# EasyEDA schematic 2023_04_07_SCH_Sensor.json

## Sheets
1 Main: TITLE: Sheet_1; REV: 1.0; Date: 2021-04-21; Sheet: 1/1; Company: Your Company
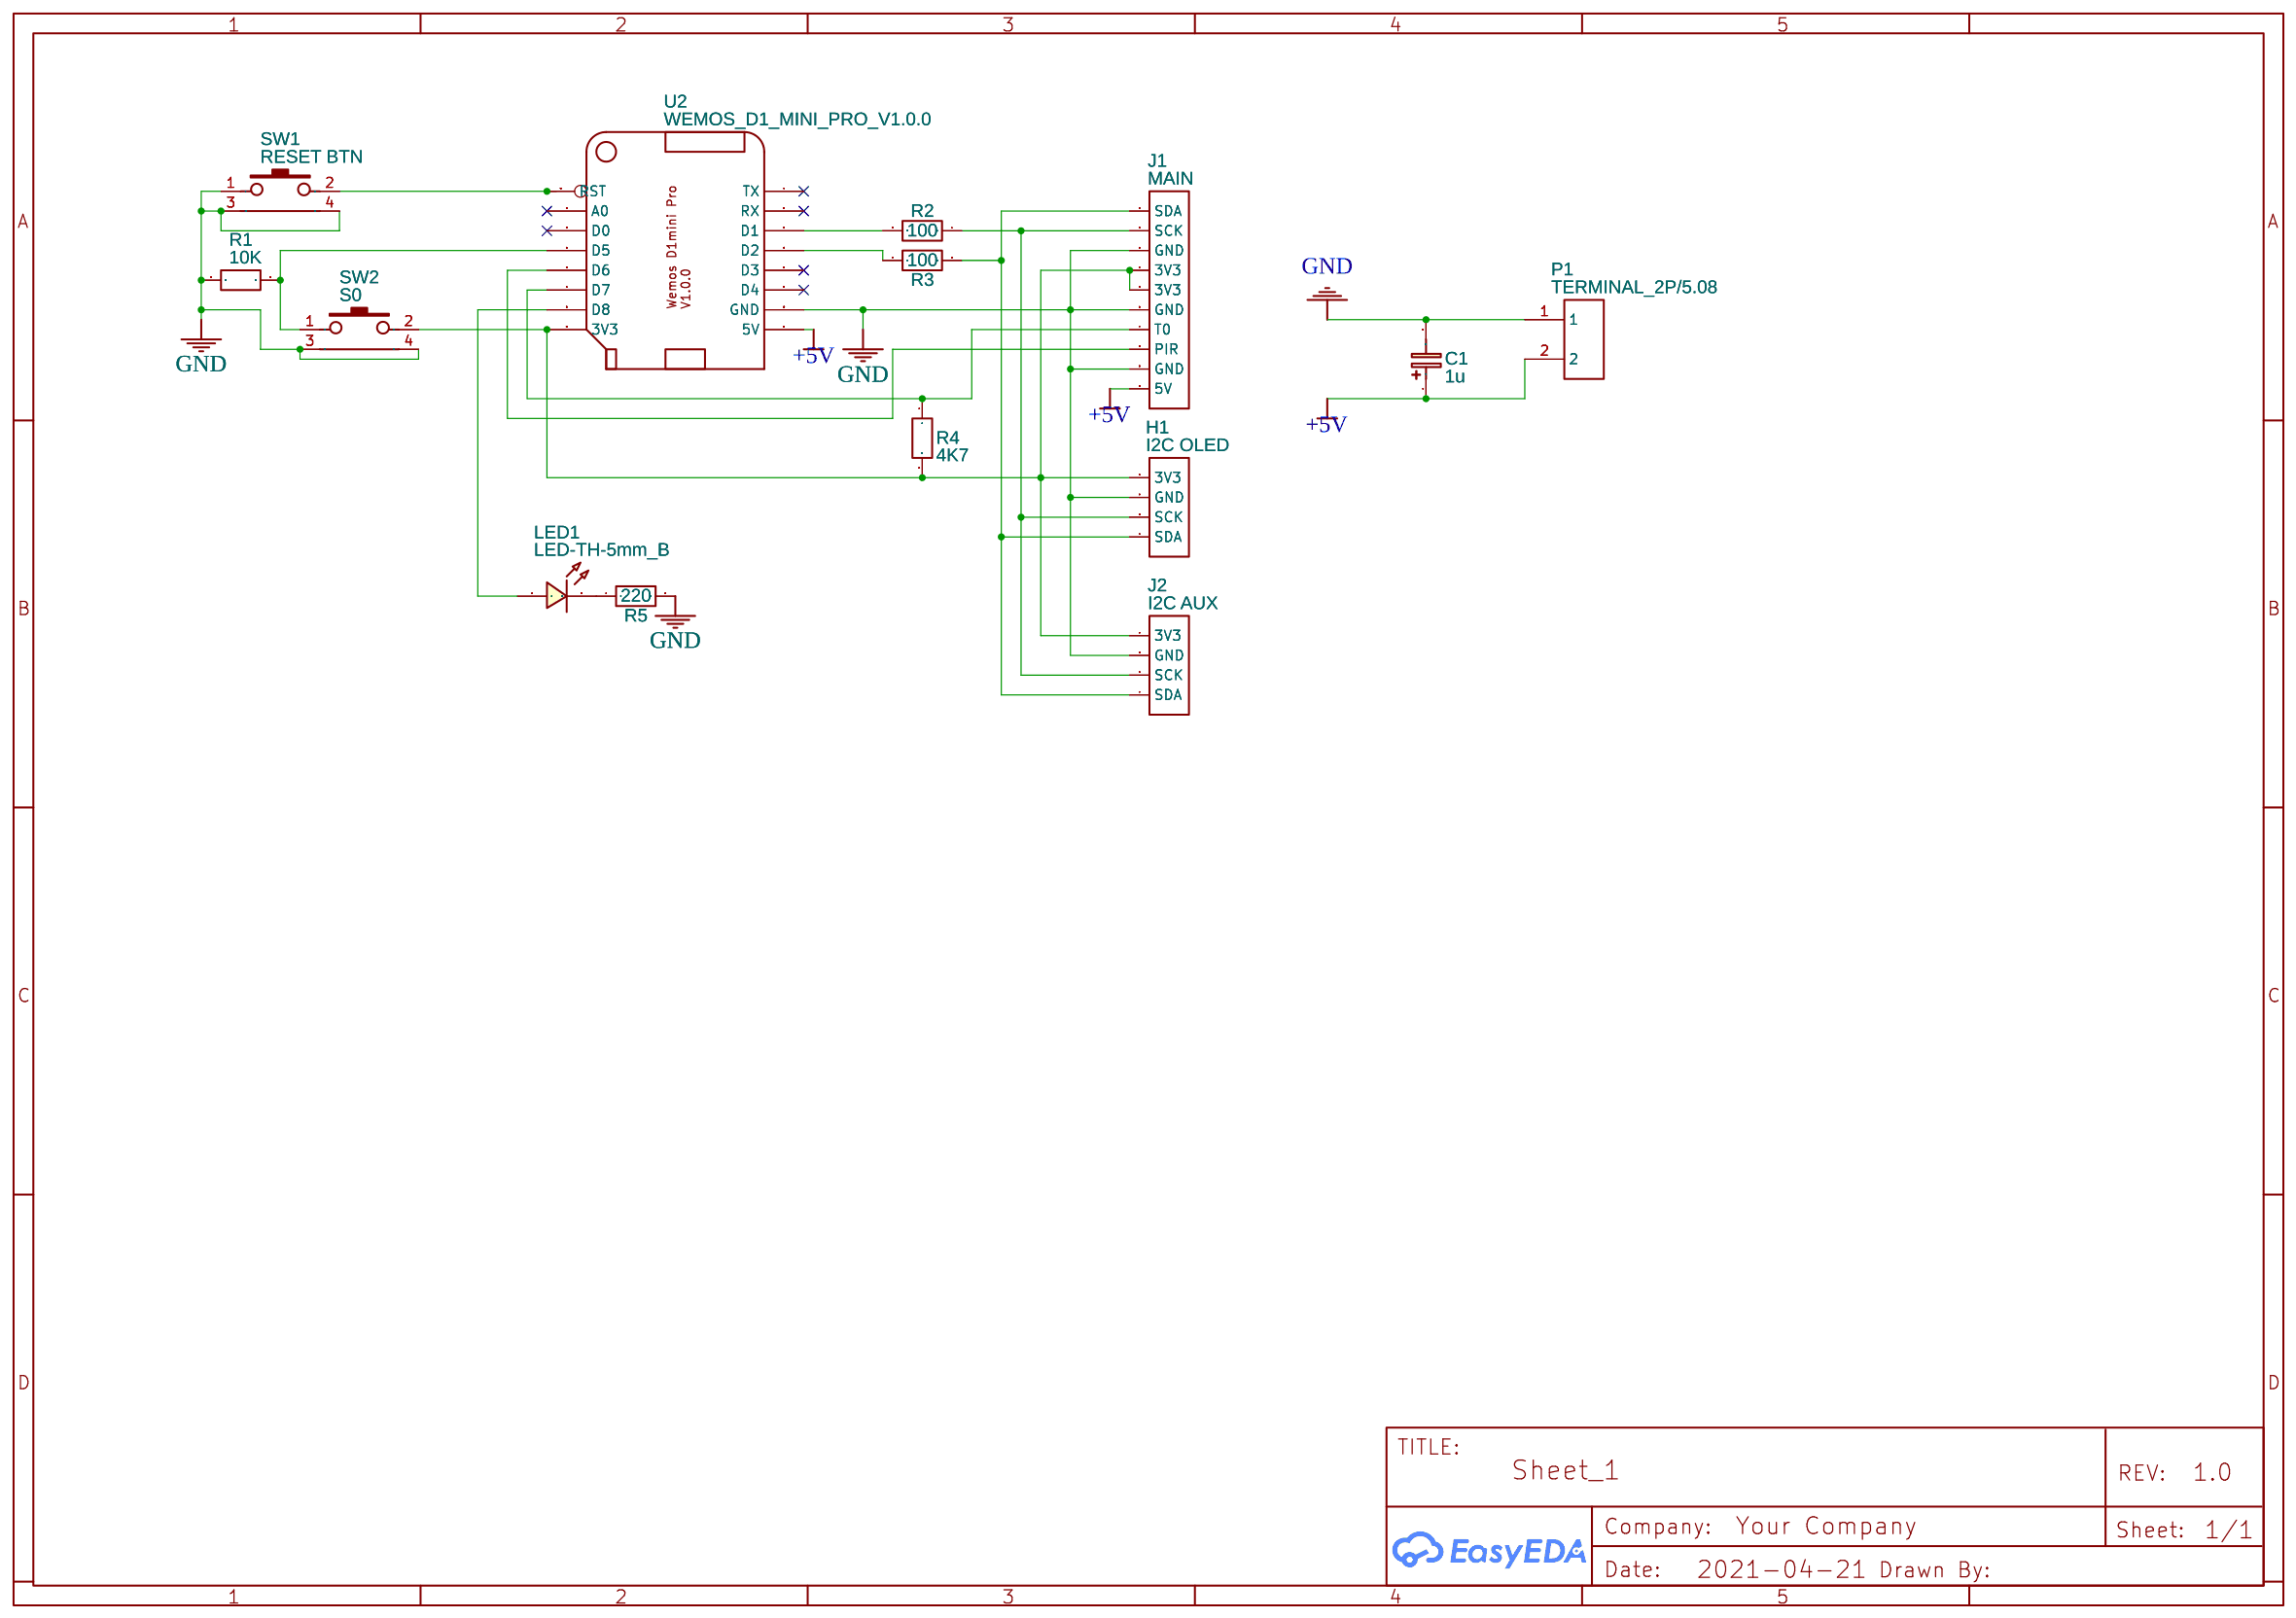
[diagram p0: Main]
2 Aux_C02: TITLE: Sheet_2; Date: 2021-12-08
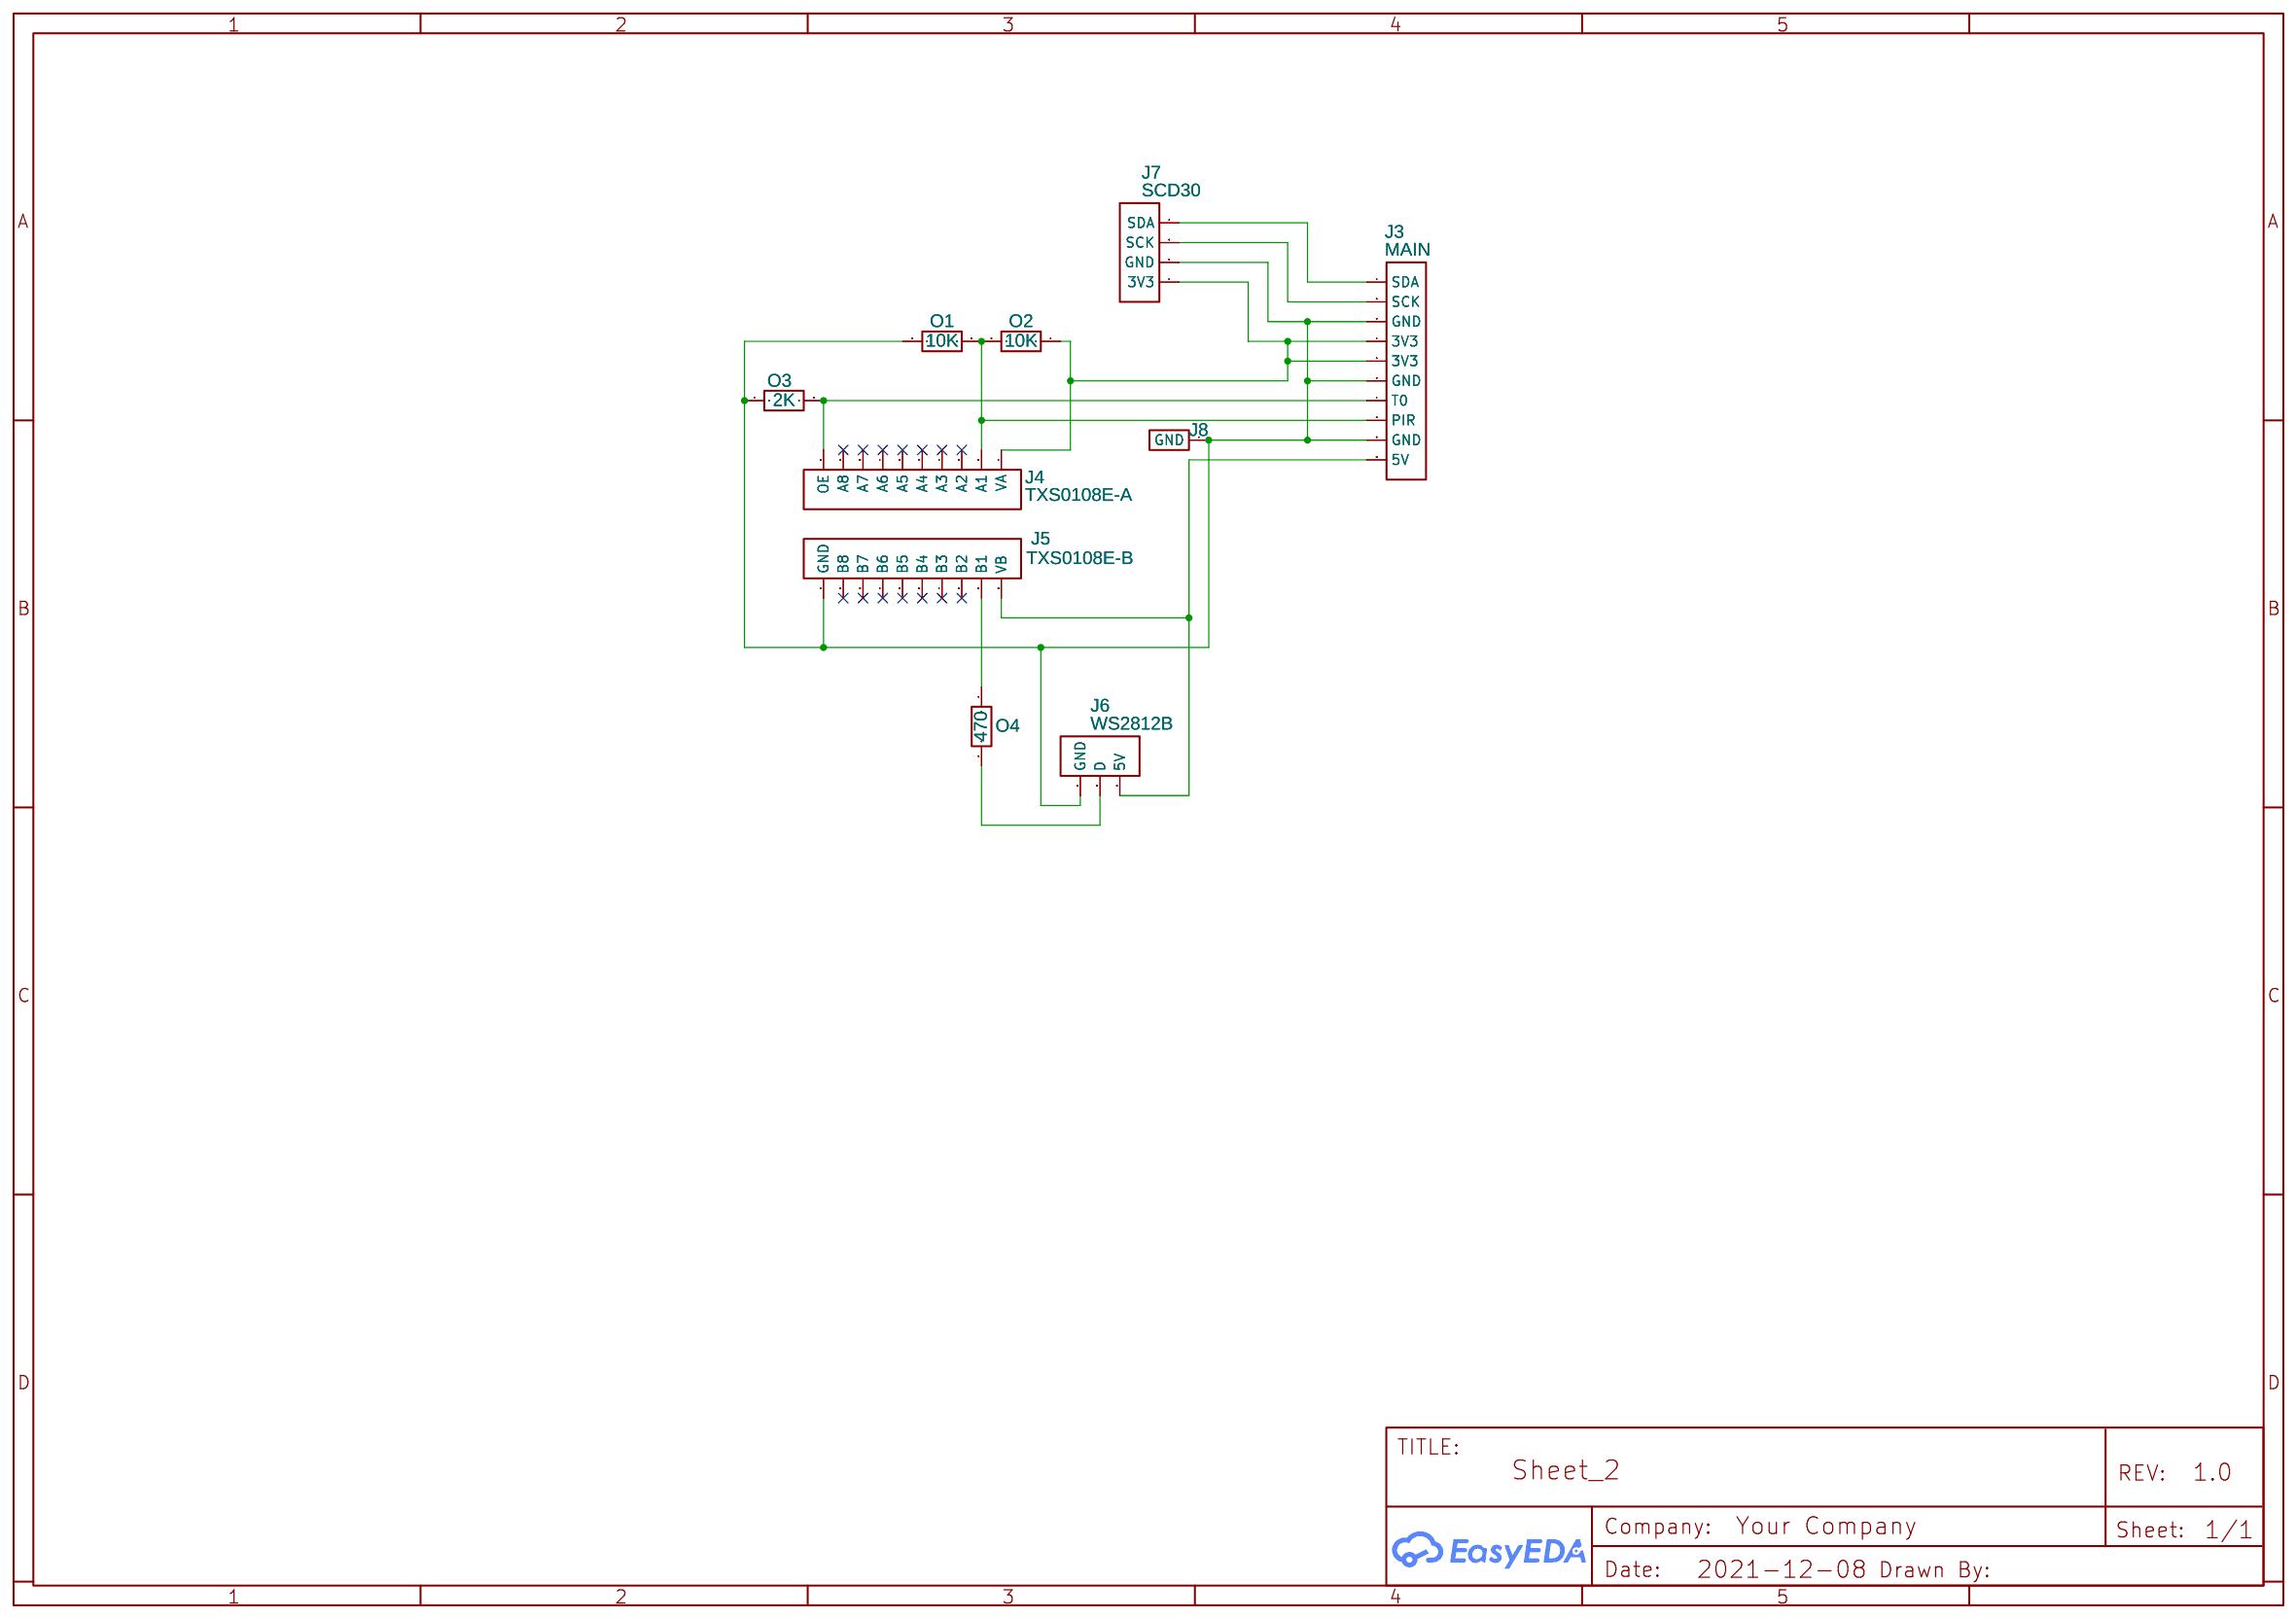
[diagram p1: Aux_C02]

## Parts
sheet Aux_C02
J3  MAIN  [HDR-M-2.54_1X10]
J4  TXS0108E-A  [HDR-M-2.54_1X10]
J5  TXS0108E-B  [HDR-M-2.54_1X10]
J6  WS2812B  [HDR-M-2.54_1X3]
J7  SCD30  [HDR-M-2.54_1X4]
J8  HDR-M-2.54_1x1  [HDR-M-2.54_1X1]
O1  10K  [R_AXIAL-0.3]
O2  10K  [R_AXIAL-0.3]
O3  2K  [R_AXIAL-0.3]
O4  470  [R_AXIAL-0.3]
sheet Main
C1  1u  [CAP-D10.0×F5.0]
H1  I2C OLED  [HDR-F-2.54_1X4]
J1  MAIN  [HDR-M-2.54_1X10]
J2  I2C AUX  [HDR-M-2.54_1X4]
LED1  LED-TH-5mm_B  [LED-TH_BD5.0_BLUE]
P1  TERMINAL_2P/5.08  [5.08-2P_SCREW_TERMINAL]
R1  10K  [R_AXIAL-0.3]
R2  100  [R_AXIAL-0.3]
R3  100  [R_AXIAL-0.3]
R4  4K7  [R_AXIAL-0.3]
R5  220  [R_AXIAL-0.3]
SW1  RESET BTN  [SW-TH_BBJ6X6X5PH260G]
SW2  S0  [SW-TH_BBJ6X6X5PH260G]
U2  WEMOS_D1_MINI_PRO_V1.0.0  [WEMOS_D1_MINI_PRO_V1.0.0]

## Library data of the parts
J1 J3-J5 = HDR-M-2.54_1x10: Supplier Part: C57369; Supplier: LCSC; Contributor: LCEDA_Lib
J6 = HDR-M-2.54_1x3: Supplier Part: C180248; Supplier: LCSC; Contributor: LCEDA_Lib
J2 J7 = HDR-M-2.54_1x4: Supplier Part: C124378; Supplier: LCSC; Contributor: LCEDA_Lib
J8 = HDR-M-2.54_1x1: Supplier Part: C81276; Supplier: LCSC; Contributor: LCEDA_Lib
O1-O4 R1-R5 = R_AXIAL-0.3_EU: Contributor: LCEDA_Lib
C1 = CE_TH_D10.0×F5.0_EU: Contributor: LCEDA_Lib
H1 = HDR-F-2.54_1x4: Supplier Part: C225501; Supplier: LCSC; Contributor: LCEDA_Lib
LED1 = LED-TH-5mm_B: Supplier: LCSC; Contributor: LCEDA_Lib
P1 = TERMINAL_2P/5.08: Manufacturer Part: Screw terminal 2p; Contributor: Giuseppe Fusi
SW1 SW2 = Button-6x6x9-Right-Angle: Supplier Part: C71842; Supplier: LCSC; Manufacturer: BBJ; Manufacturer Part: Switch,6*6*9Plastic head,260G, 0.25mm,Side bracket
U2 = WEMOS_D1_MINI_PRO_V1.0.0: Manufacturer Part: WeMos D1 Mini Pro; Supplier Part: undefined; Contributor: MiniMax

## Nets
+5V: C1.1 J1.10(5V) P1.2 U2.5V
GND: C1.2 H1.2(GND) J1.3(GND) J1.6(GND) J1.9(GND) J2.2(GND) P1.1 R1.2 R5.2 SW1.1 SW1.3 SW1.4 SW2.3 SW2.4 U2.GND
Net-(H1-1): H1.1(3V3) J1.4(3V3) J1.5(3V3) J2.1(3V3) R4.2 SW2.2 U2.3V3
Net-(H1-3): H1.3(SCK) J1.2(SCK) J2.3(SCK) R2.1
Net-(H1-4): H1.4(SDA) J1.1(SDA) J2.4(SDA) R3.2
Net-(J1-7): J1.7(T0) R4.1 U2.D7
Net-(J1-8): J1.8(PIR) U2.D6
Net-(J3-1): J3.1(SDA) J7.4(SDA)
Net-(J3-2): J3.2(SCK) J7.3(SCK)
Net-(J3-3): J3.3(GND) J3.6(GND) J3.9(GND) J5.1(GND) J6.1(GND) J7.2(GND) J8.1(GND) O1.1 O3.1
Net-(J3-4): J3.4(3V3) J3.5(3V3) J4.1(VA) J7.1(3V3) O2.1
Net-(J3-7): J3.7(T0) J4.10(OE) O3.2
Net-(J3-8): J3.8(PIR) J4.2(A1) O1.2 O2.2
Net-(J3-10): J3.10(5V) J5.10(VB) J6.3(5V)
Net-(J5-9): J5.9(B1) O4.1
Net-(J6-2): J6.2(D) O4.2
Net-(LED1-1): LED1.1 U2.D8
Net-(LED1-2): LED1.2 R5.1
Net-(R1-1): R1.1 SW2.1 U2.D5
Net-(R2-2): R2.2 U2.D1
Net-(R3-1): R3.1 U2.D2
Net-(SW1-2): SW1.2 U2.RST

Not connected (* = marked no-connect by the designer): J4 3(A2)* 4(A3)* 5(A4)* 6(A5)* 7(A6)* 8(A7)* 9(A8)*; J5 2(B8)* 3(B7)* 4(B6)* 5(B5)* 6(B4)* 7(B3)* 8(B2)*; U2 A0* D0* D3* D4* RX* TX*
